# EAGLE design EMI Shielding Test (EAGLE 9.6.2)

## Sheet 1 of 2
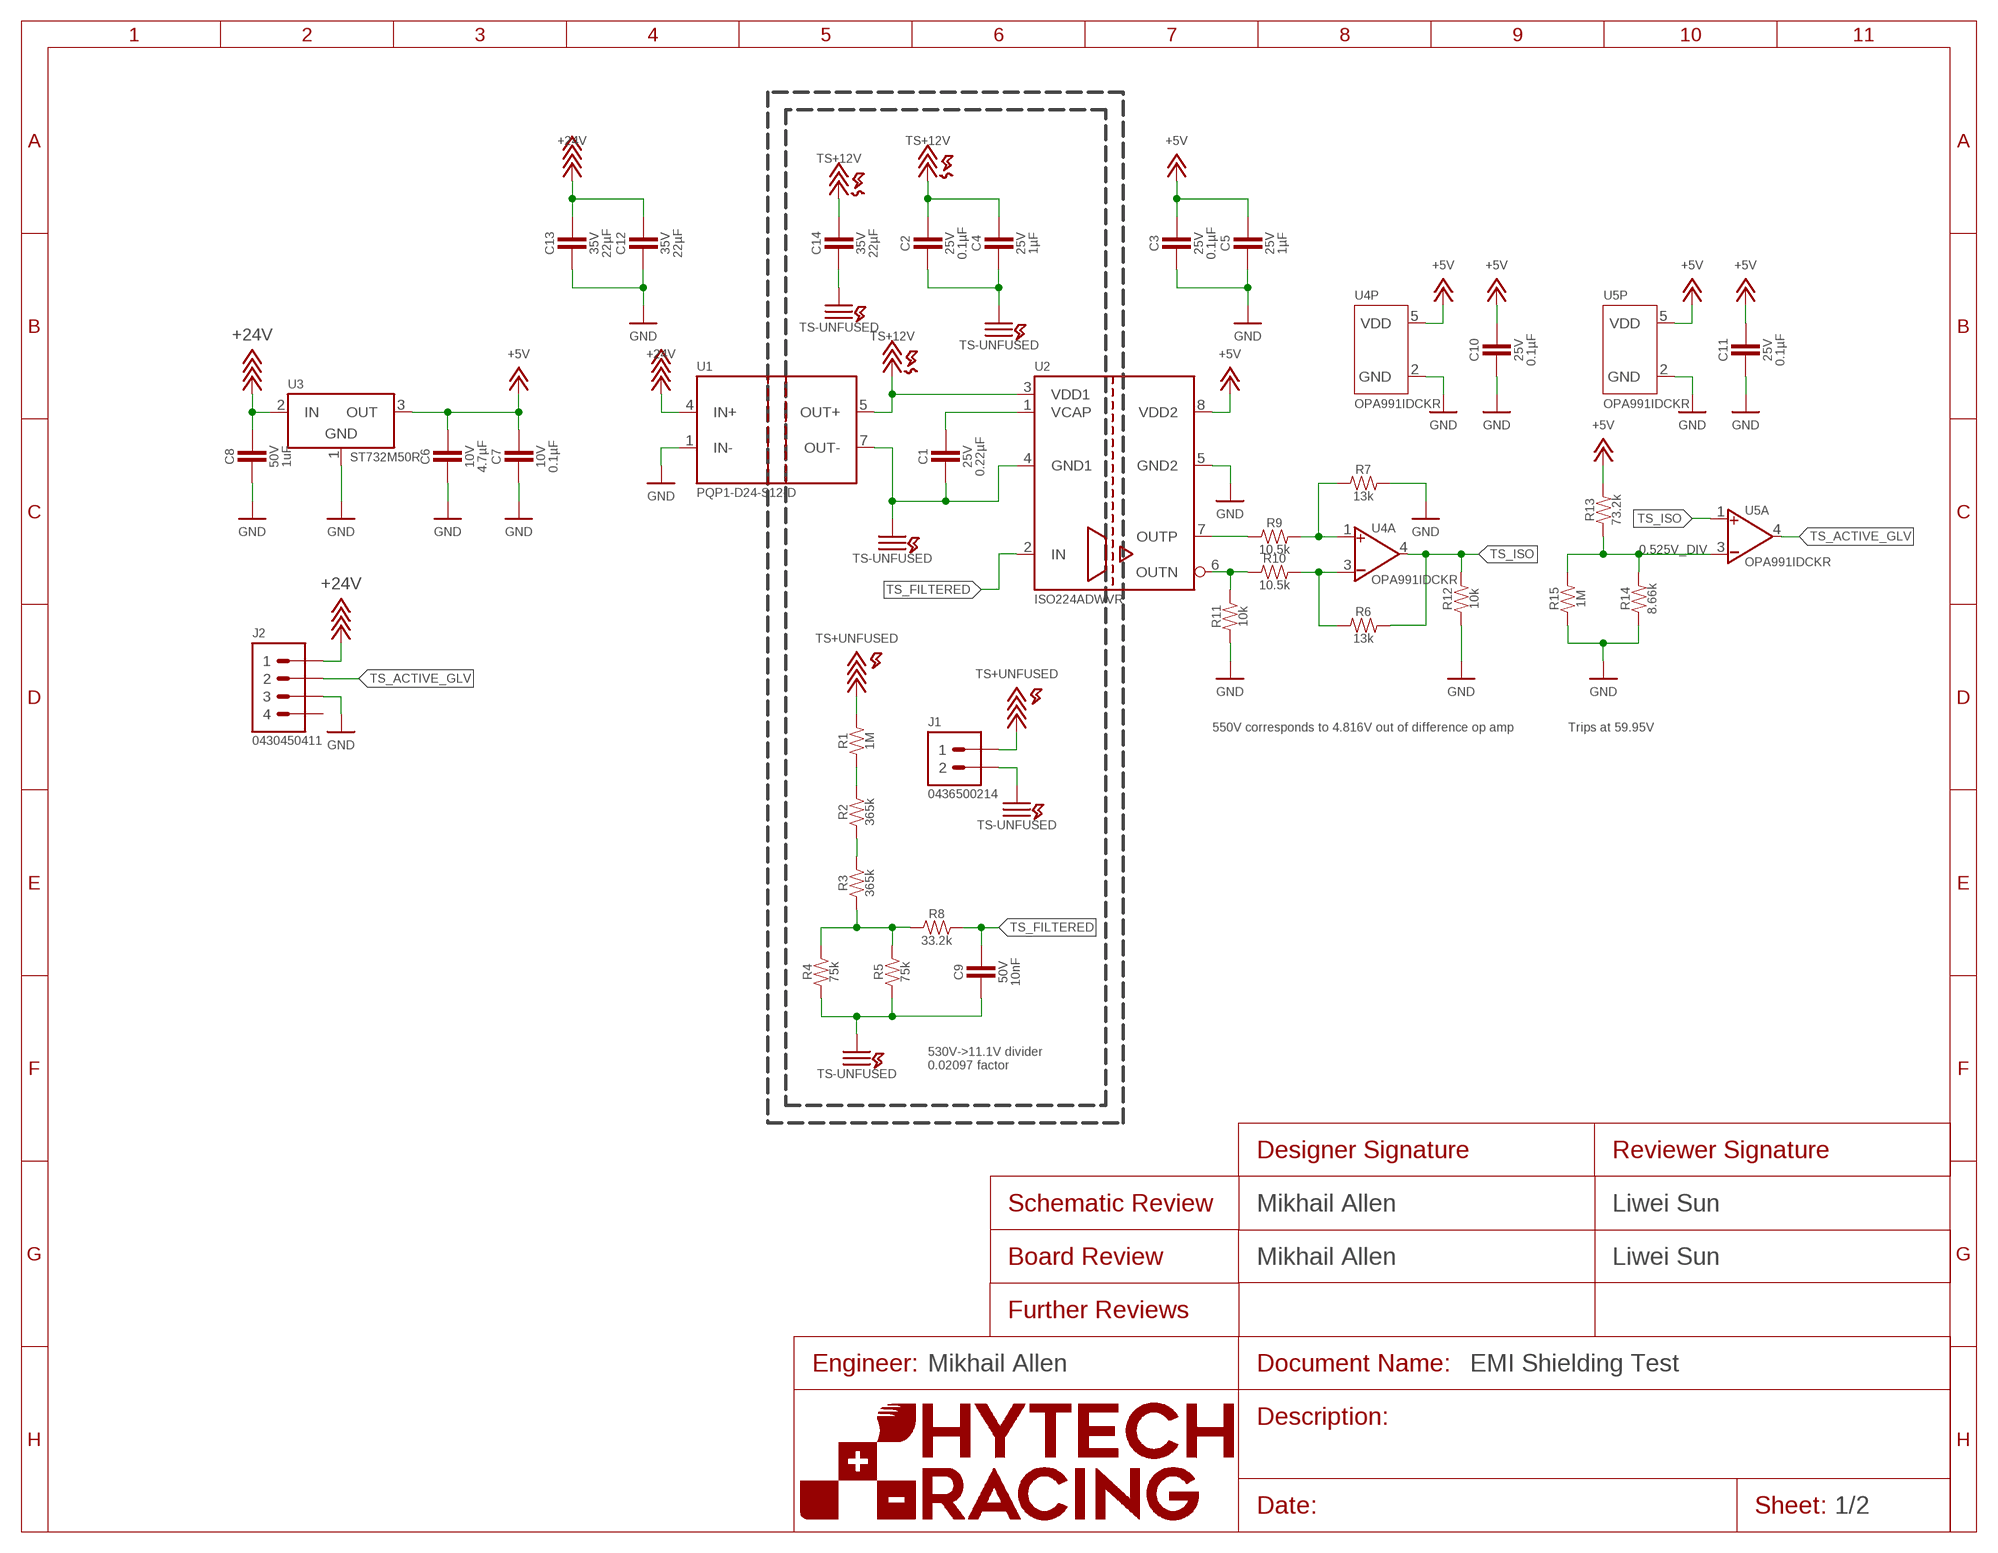
[diagram p0: schematic, sheet 1]
FRAME1 (FRAME): DESIGNER_BOARD: Mikhail Allen; DESIGNER_SCHEMATIC: Mikhail Allen; ENGINEER: Mikhail Allen; REVIEWER_BOARD: Liwei Sun; REVIEWER_SCHEMATIC: Liwei Sun

### Parts
C1  CAPACITOR_0603_25V_0.22UF  [0603-CAP]
C2  CAPACITOR_0603_25V_0.1UF  [0603-CAP]
C3  CAPACITOR_0603_25V_0.1UF  [0603-CAP]
C4  CAPACITOR_0603_25V_1UF  [0603-CAP]
C5  CAPACITOR_0603_25V_1UF  [0603-CAP]
C6  CAPACITOR_0603_10V_4.7UF  [0603-CAP]
C7  CAPACITOR_0603_10V_0.1UF  [0603-CAP]
C8  CAPACITOR_0603_50V_1UF  [0603-CAP]
C9  CAPACITOR_0603_50V_10NF  [0603-CAP]
C10  CAPACITOR_0603_25V_0.1UF  [0603-CAP]
C11  CAPACITOR_0603_25V_0.1UF  [0603-CAP]
C12  CAPACITOR_1206_35V_22UF  [1206-CAP]
C13  CAPACITOR_1206_35V_22UF  [1206-CAP]
C14  CAPACITOR_1206_35V_22UF  [1206-CAP]
J1  CONNECTOR-2_MICROFIT_SMD_RIGHTANGLE_02_SINGLE_BLACK  [MOLEX_MICROFIT_SMD_RIGHTANGLE_02_SINGLE]
J2  CONNECTOR-4_μF_S_RA_  [MOLEX_MICROFIT_SMD_RIGHTANGLE_04_DUAL]
R1  RESISTOR_0805_1M  [0805-RES]
R2  RESISTOR_0805_365K  [0805-RES]
R3  RESISTOR_0805_365K  [0805-RES]
R4  RESISTOR_0805_HV75K  [0805-RES]
R5  RESISTOR_0805_HV75K  [0805-RES]
R6  RESISTOR_0603_13K  [0603-RES]
R7  RESISTOR_0603_13K  [0603-RES]
R8  RESISTOR_0603_33.2K  [0603-RES]
R9  RESISTOR_0603_10.5K  [0603-RES]
R10  RESISTOR_0603_10.5K  [0603-RES]
R11  RESISTOR_0603_10K  [0603-RES]
R12  RESISTOR_0603_10K  [0603-RES]
R13  RESISTOR_0603_73.2K  [0603-RES]
R14  RESISTOR_0603_8.66K  [0603-RES]
R15  RESISTOR_0603_1M  [0603-RES]
U1  VOLTAGE_REGULATOR_ISO_PQP1-D_  VOLTAGE_REGULATOR_ISO_PQP1-D_D24-S12  [PQP1-D]
U2  ISO224A_AIRGAP  [SOIC-08(WIDE,0.295")-AIRGAP]
U3  VOLTAGE_REGULATOR_SOT-23-5_5V  [SOT-23-5]
U4  OPAMP_1_CHANNEL_OPA991  [SC-70-5]
U5  OPAMP_1_CHANNEL_OPA991  [SC-70-5]

### Nets
0.525V_DIV: R13.1 R14.2 R15.2 U5.3(A:VIN-)
+5V: C3.1 C5.1 C6.1 C7.1 C10.1 C11.1 R13.2 U2.8(VDD2) U3.3(OUT) U4.5(P:VDD) U5.5(P:VDD)
+24V: C8.1 C12.1 C13.1 J2.1 U1.4(IN+) U3.2(IN)
GND: C3.2 C5.2 C6.2 C7.2 C8.2 C10.2 C11.2 C12.2 C13.2 J2.3 R7.2 R11.1 R12.1 R14.1 R15.1 U1.1(IN-) U2.5(GND2) U3.1(GND) U4.2(P:GND) U5.2(P:GND)
N$1: C1.1 U2.1(VCAP)
N$2: R7.1 R9.2 U4.1(A:VIN+)
N$3: R6.1 R10.2 U4.3(A:VIN-)
N$4: R2.1 R3.2
N$5: R1.1 R2.2
N$7: R10.1 R11.2 U2.6(OUTN)
N$8: R9.1 U2.7(OUTP)
TS+12V: C2.1 C4.1 C14.1 U1.5(OUT+) U2.3(VDD1)
TS+UNFUSED: J1.1 R1.2
TS-UNFUSED: C1.2 C2.2 C4.2 C9.2 C14.2 J1.2 R4.1 R5.1 U1.7(OUT-) U2.4(GND1)
TS_ACTIVE_GLV: J2.2 U5.4(A:VOUT)
TS_DIVIDED: R3.1 R4.2 R5.2 R8.1
TS_FILTERED: C9.1 R8.2 U2.2(IN)
TS_ISO: R6.2 R12.2 U4.4(A:VOUT) U5.1(A:VIN+)
Unconnected: J2.4

### Notes on the sheet
- 550V corresponds to 4.816V out of difference op amp | Trips at 59.95V
- 530V->11.1V divider
  0.02097 factor

## Sheet 2 of 2
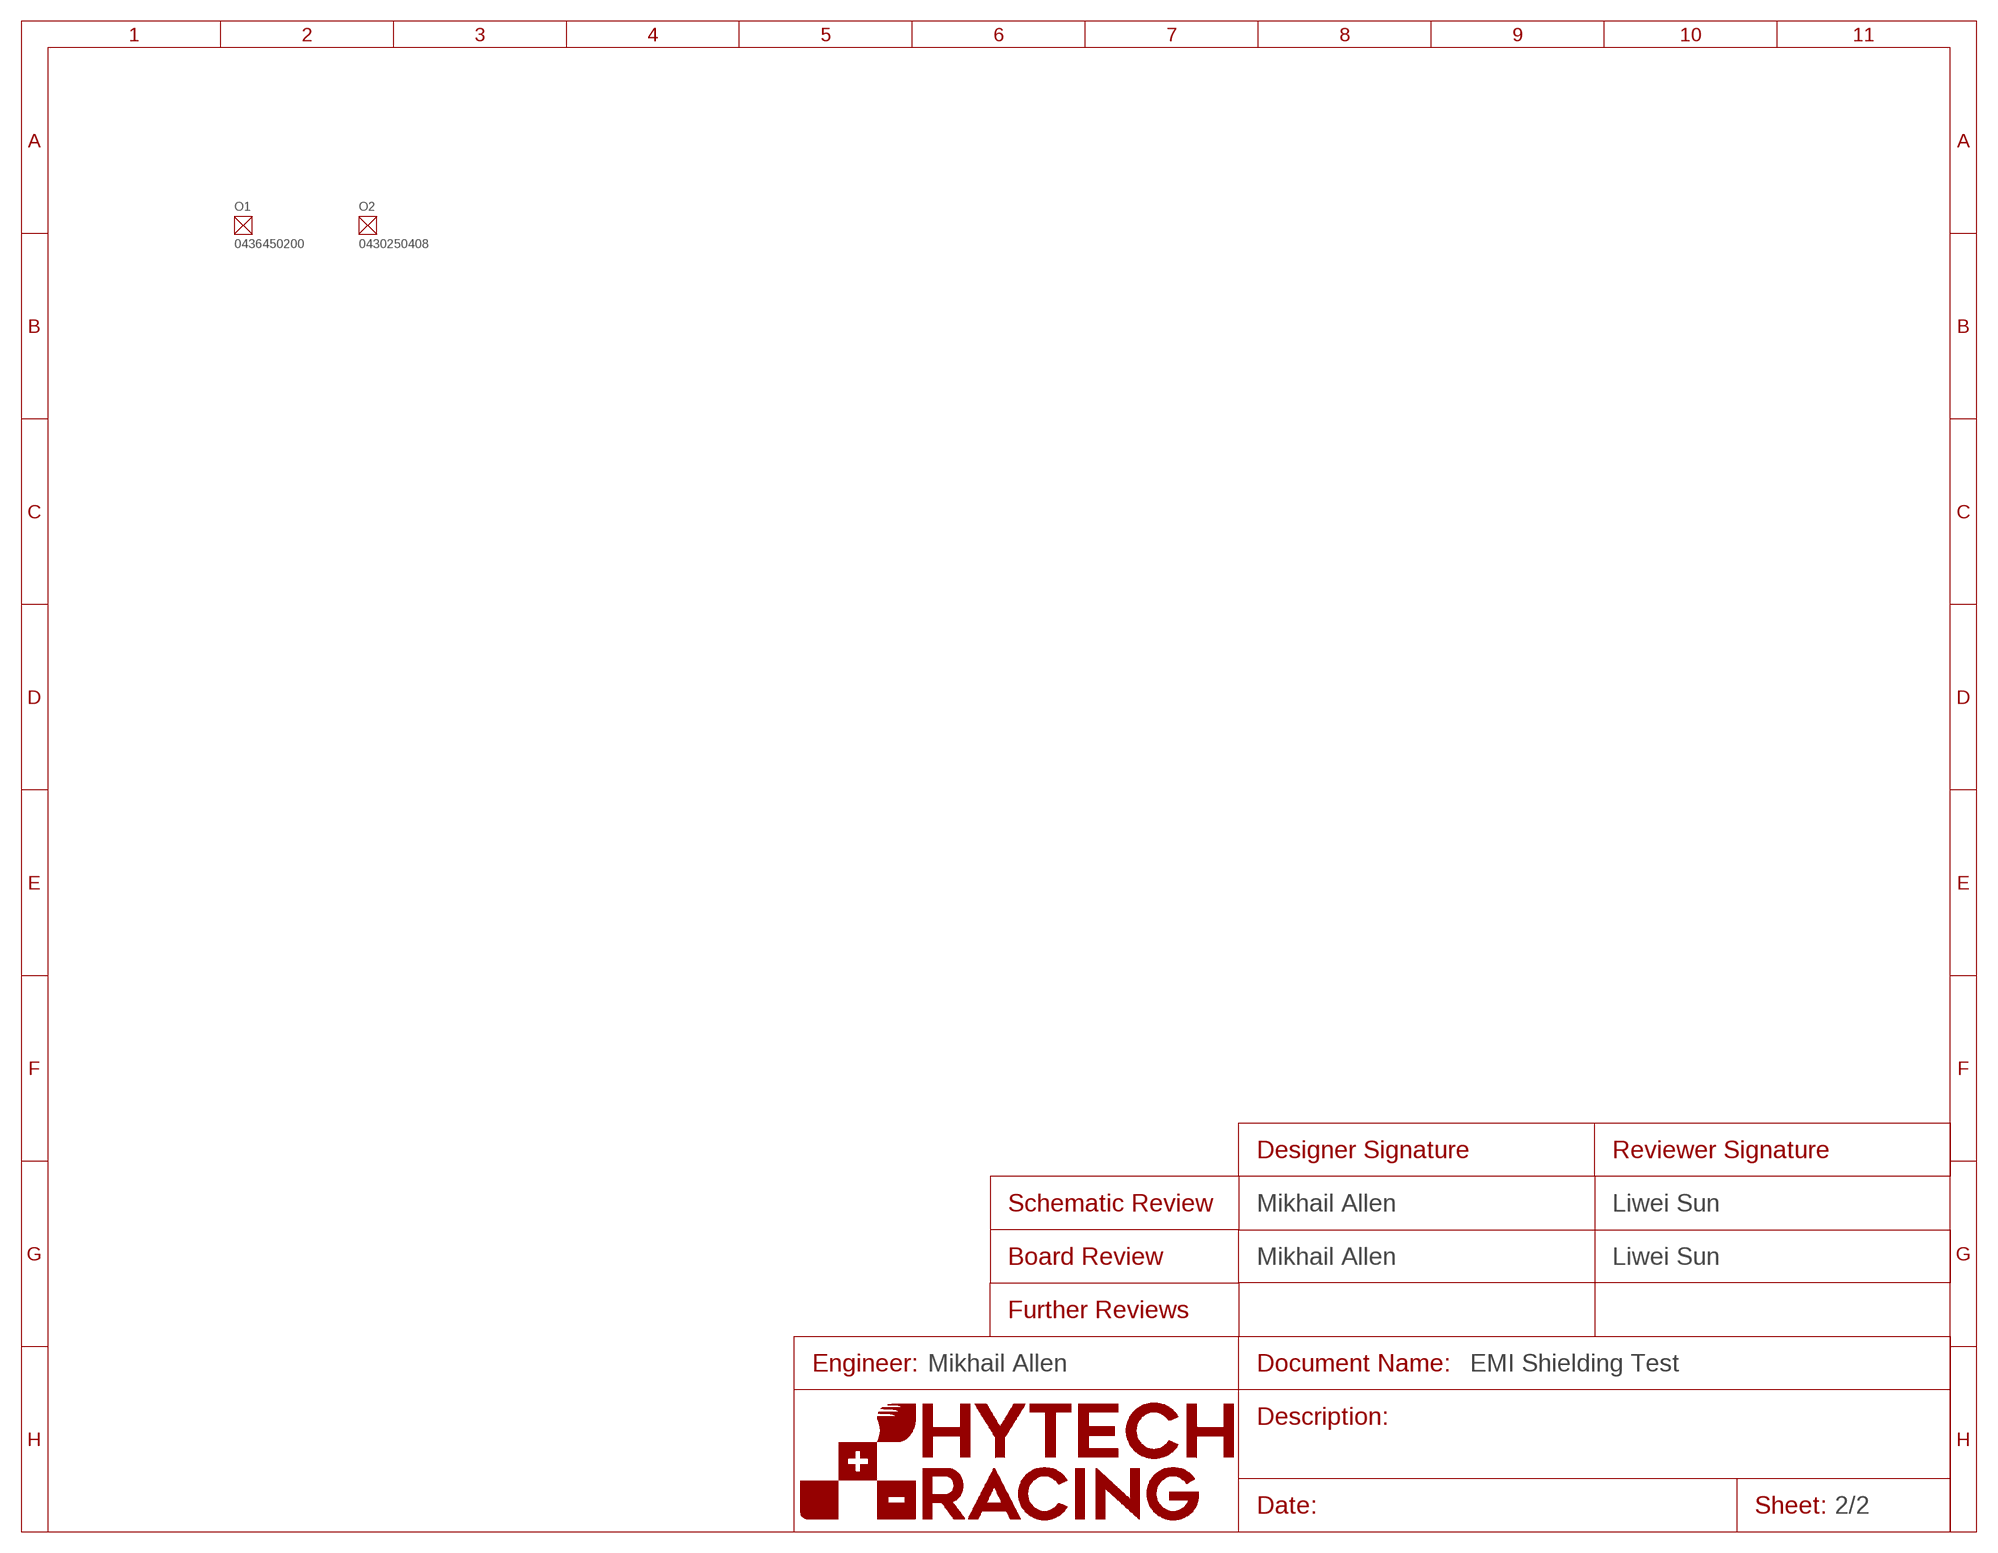
[diagram p1: schematic, sheet 2]
FRAME2 (FRAME): DESIGNER_BOARD: Mikhail Allen; DESIGNER_SCHEMATIC: Mikhail Allen; ENGINEER: Mikhail Allen; REVIEWER_BOARD: Liwei Sun; REVIEWER_SCHEMATIC: Liwei Sun
O1 (RECEPTACLE-2_MICROFIT): DKPN: WM1845-ND; MANUFACTURER: Molex; MOPN: 538-43645-0200; MPN: 0436450200
O2 (RECEPTACLE-4_MICROFIT): DKPN: WM11225-ND; MANUFACTURER: Molex; MOPN: 538-43025-0408; MPN: 0430250408

## Library data of the parts
C1 = HyTechDevices:CAPACITOR_?_*: Capacitor, Non-Polarized VJ...1BC Series Datasheet <https://www.mouser.com/datasheet/2/427/vjw1bcbascomseries-1762447.pdf> Samsung Datasheet <https://www.mouser.com/datasheet/2/585/MLCC-1837944.pdf> Walsin Datasheet <https://www.mouser.com/datasheet/2/210/WTC_MLCC_General_Purpose-1534899.pdf> GRM188R61A226ME15D <https://www.mouser.com/datasheet/2/281/1/GRM188R61A226ME15_02A-1985787.pdf> GRM188R61E106MA73D <https://www.mouser.com/datasheet/2/281/1/GRM188R61E106MA73_01A-1985806.pdf> 885012006013 <https://www.mouser.com/datasheet/2/445/885012006013-1726946.pdf> 2220Y6300105KXTWS2 <https://www.mouser.com/datasheet/2/218/SMD_High_and_Std_StackiCap_P62-1825512.pdf> Yageo Class 2, X5R <https://www.mouser.com/datasheet/2/447/UPY_GPHC_X5R_4V_to_50V_26-1827097.pdf> TDK C Series <https://www.mouser.com/ProductDetail/TDK/C3216X5R1V226M160AC?qs=%2Fha2pyFadujbcx9jh7lYl%2F4NeMoXFhdc8AqVWNq4wW6M2y7zl6GzBuhgtI0ngznN> AVX Automotive MLCC <https://www.mouser.com/datasheet/2/40/AutoMLCC-777028.pdf> KEMET X7R Series <https://www.mouser.com/datasheet/2/212/KEM_C1002_X7R_SMD-1102033.pdf> Kyocera AVX <https://www.mouser.com/datasheet/2/40/C0GNP0_Dielectric-951274.pdf> GRM21BR61H <https://www.mouser.com/datasheet/2/281/1/GRM21BR61H106KE43_01A-1986884.pdf> C1812W104KDRACTU <https://www.mouser.com/datasheet/2/212/KEM_C1034_X7R_HV_ARC_SMD-1101730.pdf>; CAPACITANCE: 0.22µF; DKPN: 1292-1420-1-ND; MANUFACTURER: Walsin Technology Corporation; MOPN: 791-0603B224K250CT; MPN: 0603B224K250CT; TOLERANCE: 10%; VOLTAGE: 25V
C2 C3 C10 C11 = HyTechDevices:CAPACITOR_?_*: Capacitor, Non-Polarized VJ...1BC Series Datasheet <https://www.mouser.com/datasheet/2/427/vjw1bcbascomseries-1762447.pdf> Samsung Datasheet <https://www.mouser.com/datasheet/2/585/MLCC-1837944.pdf> Walsin Datasheet <https://www.mouser.com/datasheet/2/210/WTC_MLCC_General_Purpose-1534899.pdf> GRM188R61A226ME15D <https://www.mouser.com/datasheet/2/281/1/GRM188R61A226ME15_02A-1985787.pdf> GRM188R61E106MA73D <https://www.mouser.com/datasheet/2/281/1/GRM188R61E106MA73_01A-1985806.pdf> 885012006013 <https://www.mouser.com/datasheet/2/445/885012006013-1726946.pdf> 2220Y6300105KXTWS2 <https://www.mouser.com/datasheet/2/218/SMD_High_and_Std_StackiCap_P62-1825512.pdf> Yageo Class 2, X5R <https://www.mouser.com/datasheet/2/447/UPY_GPHC_X5R_4V_to_50V_26-1827097.pdf> TDK C Series <https://www.mouser.com/ProductDetail/TDK/C3216X5R1V226M160AC?qs=%2Fha2pyFadujbcx9jh7lYl%2F4NeMoXFhdc8AqVWNq4wW6M2y7zl6GzBuhgtI0ngznN> AVX Automotive MLCC <https://www.mouser.com/datasheet/2/40/AutoMLCC-777028.pdf> KEMET X7R Series <https://www.mouser.com/datasheet/2/212/KEM_C1002_X7R_SMD-1102033.pdf> Kyocera AVX <https://www.mouser.com/datasheet/2/40/C0GNP0_Dielectric-951274.pdf> GRM21BR61H <https://www.mouser.com/datasheet/2/281/1/GRM21BR61H106KE43_01A-1986884.pdf> C1812W104KDRACTU <https://www.mouser.com/datasheet/2/212/KEM_C1034_X7R_HV_ARC_SMD-1101730.pdf>; CAPACITANCE: 0.1µF; DKPN: 1276-1006-1-ND; MANUFACTURER: Samsung Electro-Mechanics; MOPN: 187-CL10B104KA8NNNC; MPN: CL10B104KA8NNNC; TOLERANCE: 10%; VOLTAGE: 25V
C4 C5 = HyTechDevices:CAPACITOR_?_*: Capacitor, Non-Polarized VJ...1BC Series Datasheet <https://www.mouser.com/datasheet/2/427/vjw1bcbascomseries-1762447.pdf> Samsung Datasheet <https://www.mouser.com/datasheet/2/585/MLCC-1837944.pdf> Walsin Datasheet <https://www.mouser.com/datasheet/2/210/WTC_MLCC_General_Purpose-1534899.pdf> GRM188R61A226ME15D <https://www.mouser.com/datasheet/2/281/1/GRM188R61A226ME15_02A-1985787.pdf> GRM188R61E106MA73D <https://www.mouser.com/datasheet/2/281/1/GRM188R61E106MA73_01A-1985806.pdf> 885012006013 <https://www.mouser.com/datasheet/2/445/885012006013-1726946.pdf> 2220Y6300105KXTWS2 <https://www.mouser.com/datasheet/2/218/SMD_High_and_Std_StackiCap_P62-1825512.pdf> Yageo Class 2, X5R <https://www.mouser.com/datasheet/2/447/UPY_GPHC_X5R_4V_to_50V_26-1827097.pdf> TDK C Series <https://www.mouser.com/ProductDetail/TDK/C3216X5R1V226M160AC?qs=%2Fha2pyFadujbcx9jh7lYl%2F4NeMoXFhdc8AqVWNq4wW6M2y7zl6GzBuhgtI0ngznN> AVX Automotive MLCC <https://www.mouser.com/datasheet/2/40/AutoMLCC-777028.pdf> KEMET X7R Series <https://www.mouser.com/datasheet/2/212/KEM_C1002_X7R_SMD-1102033.pdf> Kyocera AVX <https://www.mouser.com/datasheet/2/40/C0GNP0_Dielectric-951274.pdf> GRM21BR61H <https://www.mouser.com/datasheet/2/281/1/GRM21BR61H106KE43_01A-1986884.pdf> C1812W104KDRACTU <https://www.mouser.com/datasheet/2/212/KEM_C1034_X7R_HV_ARC_SMD-1101730.pdf>; CAPACITANCE: 1µF; DKPN: 1276-1184-1-ND; MANUFACTURER: Samsung Electro-Mechanics; MOPN: 187-CL10B105KA8NNNC; MPN: CL10B105KA8NNNC; TOLERANCE: 10%; VOLTAGE: 25V
C6 = HyTechDevices:CAPACITOR_?_*: Capacitor, Non-Polarized VJ...1BC Series Datasheet <https://www.mouser.com/datasheet/2/427/vjw1bcbascomseries-1762447.pdf> Samsung Datasheet <https://www.mouser.com/datasheet/2/585/MLCC-1837944.pdf> Walsin Datasheet <https://www.mouser.com/datasheet/2/210/WTC_MLCC_General_Purpose-1534899.pdf> GRM188R61A226ME15D <https://www.mouser.com/datasheet/2/281/1/GRM188R61A226ME15_02A-1985787.pdf> GRM188R61E106MA73D <https://www.mouser.com/datasheet/2/281/1/GRM188R61E106MA73_01A-1985806.pdf> 885012006013 <https://www.mouser.com/datasheet/2/445/885012006013-1726946.pdf> 2220Y6300105KXTWS2 <https://www.mouser.com/datasheet/2/218/SMD_High_and_Std_StackiCap_P62-1825512.pdf> Yageo Class 2, X5R <https://www.mouser.com/datasheet/2/447/UPY_GPHC_X5R_4V_to_50V_26-1827097.pdf> TDK C Series <https://www.mouser.com/ProductDetail/TDK/C3216X5R1V226M160AC?qs=%2Fha2pyFadujbcx9jh7lYl%2F4NeMoXFhdc8AqVWNq4wW6M2y7zl6GzBuhgtI0ngznN> AVX Automotive MLCC <https://www.mouser.com/datasheet/2/40/AutoMLCC-777028.pdf> KEMET X7R Series <https://www.mouser.com/datasheet/2/212/KEM_C1002_X7R_SMD-1102033.pdf> Kyocera AVX <https://www.mouser.com/datasheet/2/40/C0GNP0_Dielectric-951274.pdf> GRM21BR61H <https://www.mouser.com/datasheet/2/281/1/GRM21BR61H106KE43_01A-1986884.pdf> C1812W104KDRACTU <https://www.mouser.com/datasheet/2/212/KEM_C1034_X7R_HV_ARC_SMD-1101730.pdf>; CAPACITANCE: 4.7µF; DKPN: 1276-1044-1-ND; MANUFACTURER: Samsung Electro-Mechanics; MOPN: 187-CL10A475KP8NNNC; MPN: CL10A475KP8NNNC; TOLERANCE: 10%; VOLTAGE: 10V
C7 = HyTechDevices:CAPACITOR_?_*: Capacitor, Non-Polarized VJ...1BC Series Datasheet <https://www.mouser.com/datasheet/2/427/vjw1bcbascomseries-1762447.pdf> Samsung Datasheet <https://www.mouser.com/datasheet/2/585/MLCC-1837944.pdf> Walsin Datasheet <https://www.mouser.com/datasheet/2/210/WTC_MLCC_General_Purpose-1534899.pdf> GRM188R61A226ME15D <https://www.mouser.com/datasheet/2/281/1/GRM188R61A226ME15_02A-1985787.pdf> GRM188R61E106MA73D <https://www.mouser.com/datasheet/2/281/1/GRM188R61E106MA73_01A-1985806.pdf> 885012006013 <https://www.mouser.com/datasheet/2/445/885012006013-1726946.pdf> 2220Y6300105KXTWS2 <https://www.mouser.com/datasheet/2/218/SMD_High_and_Std_StackiCap_P62-1825512.pdf> Yageo Class 2, X5R <https://www.mouser.com/datasheet/2/447/UPY_GPHC_X5R_4V_to_50V_26-1827097.pdf> TDK C Series <https://www.mouser.com/ProductDetail/TDK/C3216X5R1V226M160AC?qs=%2Fha2pyFadujbcx9jh7lYl%2F4NeMoXFhdc8AqVWNq4wW6M2y7zl6GzBuhgtI0ngznN> AVX Automotive MLCC <https://www.mouser.com/datasheet/2/40/AutoMLCC-777028.pdf> KEMET X7R Series <https://www.mouser.com/datasheet/2/212/KEM_C1002_X7R_SMD-1102033.pdf> Kyocera AVX <https://www.mouser.com/datasheet/2/40/C0GNP0_Dielectric-951274.pdf> GRM21BR61H <https://www.mouser.com/datasheet/2/281/1/GRM21BR61H106KE43_01A-1986884.pdf> C1812W104KDRACTU <https://www.mouser.com/datasheet/2/212/KEM_C1034_X7R_HV_ARC_SMD-1101730.pdf>; CAPACITANCE: 0.1µF; DKPN: 720-1688-1-ND; MANUFACTURER: Vishay Vitramon; MOPN: 77-VJ0603Y104JXQPBC; MPN: VJ0603Y104JXQPW1BC; TOLERANCE: 5%; VOLTAGE: 10V
C8 = HyTechDevices:CAPACITOR_?_*: Capacitor, Non-Polarized VJ...1BC Series Datasheet <https://www.mouser.com/datasheet/2/427/vjw1bcbascomseries-1762447.pdf> Samsung Datasheet <https://www.mouser.com/datasheet/2/585/MLCC-1837944.pdf> Walsin Datasheet <https://www.mouser.com/datasheet/2/210/WTC_MLCC_General_Purpose-1534899.pdf> GRM188R61A226ME15D <https://www.mouser.com/datasheet/2/281/1/GRM188R61A226ME15_02A-1985787.pdf> GRM188R61E106MA73D <https://www.mouser.com/datasheet/2/281/1/GRM188R61E106MA73_01A-1985806.pdf> 885012006013 <https://www.mouser.com/datasheet/2/445/885012006013-1726946.pdf> 2220Y6300105KXTWS2 <https://www.mouser.com/datasheet/2/218/SMD_High_and_Std_StackiCap_P62-1825512.pdf> Yageo Class 2, X5R <https://www.mouser.com/datasheet/2/447/UPY_GPHC_X5R_4V_to_50V_26-1827097.pdf> TDK C Series <https://www.mouser.com/ProductDetail/TDK/C3216X5R1V226M160AC?qs=%2Fha2pyFadujbcx9jh7lYl%2F4NeMoXFhdc8AqVWNq4wW6M2y7zl6GzBuhgtI0ngznN> AVX Automotive MLCC <https://www.mouser.com/datasheet/2/40/AutoMLCC-777028.pdf> KEMET X7R Series <https://www.mouser.com/datasheet/2/212/KEM_C1002_X7R_SMD-1102033.pdf> Kyocera AVX <https://www.mouser.com/datasheet/2/40/C0GNP0_Dielectric-951274.pdf> GRM21BR61H <https://www.mouser.com/datasheet/2/281/1/GRM21BR61H106KE43_01A-1986884.pdf> C1812W104KDRACTU <https://www.mouser.com/datasheet/2/212/KEM_C1034_X7R_HV_ARC_SMD-1101730.pdf>; CAPACITANCE: 1uF; DKPN: 587-2400-2-ND; MANUFACTURER: Taiyo Yuden; MOPN: 963-UMK107BJ105KA-T; MPN: UMK107BJ105KA-T; TOLERANCE: 10%; VOLTAGE: 50V
C9 = HyTechDevices:CAPACITOR_?_*: Capacitor, Non-Polarized VJ...1BC Series Datasheet <https://www.mouser.com/datasheet/2/427/vjw1bcbascomseries-1762447.pdf> Samsung Datasheet <https://www.mouser.com/datasheet/2/585/MLCC-1837944.pdf> Walsin Datasheet <https://www.mouser.com/datasheet/2/210/WTC_MLCC_General_Purpose-1534899.pdf> GRM188R61A226ME15D <https://www.mouser.com/datasheet/2/281/1/GRM188R61A226ME15_02A-1985787.pdf> GRM188R61E106MA73D <https://www.mouser.com/datasheet/2/281/1/GRM188R61E106MA73_01A-1985806.pdf> 885012006013 <https://www.mouser.com/datasheet/2/445/885012006013-1726946.pdf> 2220Y6300105KXTWS2 <https://www.mouser.com/datasheet/2/218/SMD_High_and_Std_StackiCap_P62-1825512.pdf> Yageo Class 2, X5R <https://www.mouser.com/datasheet/2/447/UPY_GPHC_X5R_4V_to_50V_26-1827097.pdf> TDK C Series <https://www.mouser.com/ProductDetail/TDK/C3216X5R1V226M160AC?qs=%2Fha2pyFadujbcx9jh7lYl%2F4NeMoXFhdc8AqVWNq4wW6M2y7zl6GzBuhgtI0ngznN> AVX Automotive MLCC <https://www.mouser.com/datasheet/2/40/AutoMLCC-777028.pdf> KEMET X7R Series <https://www.mouser.com/datasheet/2/212/KEM_C1002_X7R_SMD-1102033.pdf> Kyocera AVX <https://www.mouser.com/datasheet/2/40/C0GNP0_Dielectric-951274.pdf> GRM21BR61H <https://www.mouser.com/datasheet/2/281/1/GRM21BR61H106KE43_01A-1986884.pdf> C1812W104KDRACTU <https://www.mouser.com/datasheet/2/212/KEM_C1034_X7R_HV_ARC_SMD-1101730.pdf>; CAPACITANCE: 10nF; DKPN: 445-7404-1-ND; MANUFACTURER: TDK Corporation; MOPN: 810-C1608C0G1H103J; MPN: C1608C0G1H103J080AA; TOLERANCE: 5%; VOLTAGE: 50V
C12-C14 = HyTechDevices:CAPACITOR_?_*: Capacitor, Non-Polarized VJ...1BC Series Datasheet <https://www.mouser.com/datasheet/2/427/vjw1bcbascomseries-1762447.pdf> Samsung Datasheet <https://www.mouser.com/datasheet/2/585/MLCC-1837944.pdf> Walsin Datasheet <https://www.mouser.com/datasheet/2/210/WTC_MLCC_General_Purpose-1534899.pdf> GRM188R61A226ME15D <https://www.mouser.com/datasheet/2/281/1/GRM188R61A226ME15_02A-1985787.pdf> GRM188R61E106MA73D <https://www.mouser.com/datasheet/2/281/1/GRM188R61E106MA73_01A-1985806.pdf> 885012006013 <https://www.mouser.com/datasheet/2/445/885012006013-1726946.pdf> 2220Y6300105KXTWS2 <https://www.mouser.com/datasheet/2/218/SMD_High_and_Std_StackiCap_P62-1825512.pdf> Yageo Class 2, X5R <https://www.mouser.com/datasheet/2/447/UPY_GPHC_X5R_4V_to_50V_26-1827097.pdf> TDK C Series <https://www.mouser.com/ProductDetail/TDK/C3216X5R1V226M160AC?qs=%2Fha2pyFadujbcx9jh7lYl%2F4NeMoXFhdc8AqVWNq4wW6M2y7zl6GzBuhgtI0ngznN> AVX Automotive MLCC <https://www.mouser.com/datasheet/2/40/AutoMLCC-777028.pdf> KEMET X7R Series <https://www.mouser.com/datasheet/2/212/KEM_C1002_X7R_SMD-1102033.pdf> Kyocera AVX <https://www.mouser.com/datasheet/2/40/C0GNP0_Dielectric-951274.pdf> GRM21BR61H <https://www.mouser.com/datasheet/2/281/1/GRM21BR61H106KE43_01A-1986884.pdf> C1812W104KDRACTU <https://www.mouser.com/datasheet/2/212/KEM_C1034_X7R_HV_ARC_SMD-1101730.pdf>; CAPACITANCE: 22µF; DKPN: 445-8045-1-ND; MANUFACTURER: TDK Corporation; MOPN: 810-C3216X5R1V226M; MPN: C3216X5R1V226M160AC; TOLERANCE: 20%; VOLTAGE: 35V
J1 = HyTechDevices:CONNECTOR-2_?_*: 2 Pin Connector; DKPN: WM14310CT-ND; MANUFACTURER: Molex; MOPN: 538-43650-0214; MPN: 0436500214
J2 = HyTechDevices:CONNECTOR-4_?_*: 4 Pin Connector; DKPN: WM1832CT-ND; MANUFACTURER: Molex; MOPN: 538-0430450411; MPN: 0430450411
R1 = HyTechDevices:RESISTOR_?_*: Resistor PWR163 Series <https://www.mouser.com/datasheet/2/54/pwr163-777985.pdf> AC Series <https://www.mouser.com/datasheet/2/447/Yageo_PYu_AC_51_RoHS_L_7_1714230-1874691.pdf> PU Series <https://www.mouser.com/datasheet/2/447/PYu-PU_51_RoHS_L_6-1504619.pdf> ERA Series <https://www.mouser.com/datasheet/2/315/AOA0000C307-1149632.pdf> PWR263 Series <https://www.mouser.com/datasheet/2/54/pwr263s_35-778069.pdf> KTR Series <https://www.mouser.com/datasheet/2/348/ROHM_S_A0011075115_1-2563276.pdf> RC Series <https://www.mouser.com/datasheet/2/447/Yageo_03_18_2021_PYu_RC_Group_51_RoHS_L_11-2199992.pdf> ERJ PB3, PB6 Series <https://www.mouser.com/datasheet/2/315/AOA0000C328-1530132.pdf> ERJ PA2, P03, PA3, P06, P08, P14 Series <https://www.mouser.com/datasheet/2/315/AOA0000C331-1141874.pdf> B20 Series <https://www.ohmite.com/assets/docs/res_200.pdf?r=false> TE Connectivity/Holsworthy RN73 Series <https://www.mouser.com/datasheet/2/418/4/NG_DS_1773270_M-604713.pdf> Vishay Dale D/CRCW e3 <https://www.mouser.com/datasheet/2/427/dcrcwe3-1762152.pdf> Ohmite B20 <https://www.ohmite.com/assets/docs/res_200.pdf?r=false>; DKPN: P20936TR-ND; MANUFACTURER: Panasonic Electronic Components; MOPN: 667-ERJ-PB6B1004V; MPN: ERJ-PB6B1004V; POWER: 0.25W; RESISTANCE: 1M; TOLERANCE: 0.1%; VOLTAGE_CONTINUOUS: 150V; VOLTAGE_MAX: 150V
R2 R3 = HyTechDevices:RESISTOR_?_*: Resistor PWR163 Series <https://www.mouser.com/datasheet/2/54/pwr163-777985.pdf> AC Series <https://www.mouser.com/datasheet/2/447/Yageo_PYu_AC_51_RoHS_L_7_1714230-1874691.pdf> PU Series <https://www.mouser.com/datasheet/2/447/PYu-PU_51_RoHS_L_6-1504619.pdf> ERA Series <https://www.mouser.com/datasheet/2/315/AOA0000C307-1149632.pdf> PWR263 Series <https://www.mouser.com/datasheet/2/54/pwr263s_35-778069.pdf> KTR Series <https://www.mouser.com/datasheet/2/348/ROHM_S_A0011075115_1-2563276.pdf> RC Series <https://www.mouser.com/datasheet/2/447/Yageo_03_18_2021_PYu_RC_Group_51_RoHS_L_11-2199992.pdf> ERJ PB3, PB6 Series <https://www.mouser.com/datasheet/2/315/AOA0000C328-1530132.pdf> ERJ PA2, P03, PA3, P06, P08, P14 Series <https://www.mouser.com/datasheet/2/315/AOA0000C331-1141874.pdf> B20 Series <https://www.ohmite.com/assets/docs/res_200.pdf?r=false> TE Connectivity/Holsworthy RN73 Series <https://www.mouser.com/datasheet/2/418/4/NG_DS_1773270_M-604713.pdf> Vishay Dale D/CRCW e3 <https://www.mouser.com/datasheet/2/427/dcrcwe3-1762152.pdf> Ohmite B20 <https://www.ohmite.com/assets/docs/res_200.pdf?r=false>; DKPN: P20885CT-ND; MANUFACTURER: Panasonic Electronic Components; MOPN: 667-ERJ-PB6B3653V; MPN: ERJ-PB6B3653V; POWER: 0.25W; RESISTANCE: 365k; TOLERANCE: 0.1%; VOLTAGE_CONTINUOUS: 150V; VOLTAGE_MAX: 150V
R4 R5 = HyTechDevices:RESISTOR_?_*: Resistor PWR163 Series <https://www.mouser.com/datasheet/2/54/pwr163-777985.pdf> AC Series <https://www.mouser.com/datasheet/2/447/Yageo_PYu_AC_51_RoHS_L_7_1714230-1874691.pdf> PU Series <https://www.mouser.com/datasheet/2/447/PYu-PU_51_RoHS_L_6-1504619.pdf> ERA Series <https://www.mouser.com/datasheet/2/315/AOA0000C307-1149632.pdf> PWR263 Series <https://www.mouser.com/datasheet/2/54/pwr263s_35-778069.pdf> KTR Series <https://www.mouser.com/datasheet/2/348/ROHM_S_A0011075115_1-2563276.pdf> RC Series <https://www.mouser.com/datasheet/2/447/Yageo_03_18_2021_PYu_RC_Group_51_RoHS_L_11-2199992.pdf> ERJ PB3, PB6 Series <https://www.mouser.com/datasheet/2/315/AOA0000C328-1530132.pdf> ERJ PA2, P03, PA3, P06, P08, P14 Series <https://www.mouser.com/datasheet/2/315/AOA0000C331-1141874.pdf> B20 Series <https://www.ohmite.com/assets/docs/res_200.pdf?r=false> TE Connectivity/Holsworthy RN73 Series <https://www.mouser.com/datasheet/2/418/4/NG_DS_1773270_M-604713.pdf> Vishay Dale D/CRCW e3 <https://www.mouser.com/datasheet/2/427/dcrcwe3-1762152.pdf> Ohmite B20 <https://www.ohmite.com/assets/docs/res_200.pdf?r=false>; DKPN: RHM75KAHTR-ND; MANUFACTURER: Rohm Semiconductor; MOPN: 755-KTR10EZPF7502; MPN: KTR10EZPF7502; POWER: 0.125W; RESISTANCE: 75k; TOLERANCE: 1%; VOLTAGE_CONTINUOUS: 96.8V; VOLTAGE_MAX: 400V
R6 R7 = HyTechDevices:RESISTOR_?_*: Resistor PWR163 Series <https://www.mouser.com/datasheet/2/54/pwr163-777985.pdf> AC Series <https://www.mouser.com/datasheet/2/447/Yageo_PYu_AC_51_RoHS_L_7_1714230-1874691.pdf> PU Series <https://www.mouser.com/datasheet/2/447/PYu-PU_51_RoHS_L_6-1504619.pdf> ERA Series <https://www.mouser.com/datasheet/2/315/AOA0000C307-1149632.pdf> PWR263 Series <https://www.mouser.com/datasheet/2/54/pwr263s_35-778069.pdf> KTR Series <https://www.mouser.com/datasheet/2/348/ROHM_S_A0011075115_1-2563276.pdf> RC Series <https://www.mouser.com/datasheet/2/447/Yageo_03_18_2021_PYu_RC_Group_51_RoHS_L_11-2199992.pdf> ERJ PB3, PB6 Series <https://www.mouser.com/datasheet/2/315/AOA0000C328-1530132.pdf> ERJ PA2, P03, PA3, P06, P08, P14 Series <https://www.mouser.com/datasheet/2/315/AOA0000C331-1141874.pdf> B20 Series <https://www.ohmite.com/assets/docs/res_200.pdf?r=false> TE Connectivity/Holsworthy RN73 Series <https://www.mouser.com/datasheet/2/418/4/NG_DS_1773270_M-604713.pdf> Vishay Dale D/CRCW e3 <https://www.mouser.com/datasheet/2/427/dcrcwe3-1762152.pdf> Ohmite B20 <https://www.ohmite.com/assets/docs/res_200.pdf?r=false>; DKPN: P13KBECT-ND; MANUFACTURER: Panasonic Electronic Components; MOPN: 667-ERA-3ARW133V; MPN: ERA-3ARW133V; POWER: 0.1W; RESISTANCE: 13k; TOLERANCE: 0.05%; VOLTAGE_CONTINUOUS: 75V; VOLTAGE_MAX: 150V
R8 = HyTechDevices:RESISTOR_?_*: Resistor PWR163 Series <https://www.mouser.com/datasheet/2/54/pwr163-777985.pdf> AC Series <https://www.mouser.com/datasheet/2/447/Yageo_PYu_AC_51_RoHS_L_7_1714230-1874691.pdf> PU Series <https://www.mouser.com/datasheet/2/447/PYu-PU_51_RoHS_L_6-1504619.pdf> ERA Series <https://www.mouser.com/datasheet/2/315/AOA0000C307-1149632.pdf> PWR263 Series <https://www.mouser.com/datasheet/2/54/pwr263s_35-778069.pdf> KTR Series <https://www.mouser.com/datasheet/2/348/ROHM_S_A0011075115_1-2563276.pdf> RC Series <https://www.mouser.com/datasheet/2/447/Yageo_03_18_2021_PYu_RC_Group_51_RoHS_L_11-2199992.pdf> ERJ PB3, PB6 Series <https://www.mouser.com/datasheet/2/315/AOA0000C328-1530132.pdf> ERJ PA2, P03, PA3, P06, P08, P14 Series <https://www.mouser.com/datasheet/2/315/AOA0000C331-1141874.pdf> B20 Series <https://www.ohmite.com/assets/docs/res_200.pdf?r=false> TE Connectivity/Holsworthy RN73 Series <https://www.mouser.com/datasheet/2/418/4/NG_DS_1773270_M-604713.pdf> Vishay Dale D/CRCW e3 <https://www.mouser.com/datasheet/2/427/dcrcwe3-1762152.pdf> Ohmite B20 <https://www.ohmite.com/assets/docs/res_200.pdf?r=false>; DKPN: P20144TR-ND; MANUFACTURER: Panasonic Electronic Components; MOPN: 667-ERJ-PB3B3322V; MPN: ERJ-PB3B3322V; POWER: 0.1W; RESISTANCE: 33.2k; TOLERANCE: 0.1%; VOLTAGE_CONTINUOUS: 57.61V; VOLTAGE_MAX: 75V
R9 R10 = HyTechDevices:RESISTOR_?_*: Resistor PWR163 Series <https://www.mouser.com/datasheet/2/54/pwr163-777985.pdf> AC Series <https://www.mouser.com/datasheet/2/447/Yageo_PYu_AC_51_RoHS_L_7_1714230-1874691.pdf> PU Series <https://www.mouser.com/datasheet/2/447/PYu-PU_51_RoHS_L_6-1504619.pdf> ERA Series <https://www.mouser.com/datasheet/2/315/AOA0000C307-1149632.pdf> PWR263 Series <https://www.mouser.com/datasheet/2/54/pwr263s_35-778069.pdf> KTR Series <https://www.mouser.com/datasheet/2/348/ROHM_S_A0011075115_1-2563276.pdf> RC Series <https://www.mouser.com/datasheet/2/447/Yageo_03_18_2021_PYu_RC_Group_51_RoHS_L_11-2199992.pdf> ERJ PB3, PB6 Series <https://www.mouser.com/datasheet/2/315/AOA0000C328-1530132.pdf> ERJ PA2, P03, PA3, P06, P08, P14 Series <https://www.mouser.com/datasheet/2/315/AOA0000C331-1141874.pdf> B20 Series <https://www.ohmite.com/assets/docs/res_200.pdf?r=false> TE Connectivity/Holsworthy RN73 Series <https://www.mouser.com/datasheet/2/418/4/NG_DS_1773270_M-604713.pdf> Vishay Dale D/CRCW e3 <https://www.mouser.com/datasheet/2/427/dcrcwe3-1762152.pdf> Ohmite B20 <https://www.ohmite.com/assets/docs/res_200.pdf?r=false>; DKPN: P10.5KDBCT-ND; MANUFACTURER: Panasonic Electronic Components; MOPN: 677-ERA-3AEB1052V; MPN: ERA-3AEB1052V; POWER: 0.1W; RESISTANCE: 10.5k; TOLERANCE: 0.1%; VOLTAGE_CONTINUOUS: 32.40V; VOLTAGE_MAX: 75V
R11 R12 = HyTechDevices:RESISTOR_?_*: Resistor PWR163 Series <https://www.mouser.com/datasheet/2/54/pwr163-777985.pdf> AC Series <https://www.mouser.com/datasheet/2/447/Yageo_PYu_AC_51_RoHS_L_7_1714230-1874691.pdf> PU Series <https://www.mouser.com/datasheet/2/447/PYu-PU_51_RoHS_L_6-1504619.pdf> ERA Series <https://www.mouser.com/datasheet/2/315/AOA0000C307-1149632.pdf> PWR263 Series <https://www.mouser.com/datasheet/2/54/pwr263s_35-778069.pdf> KTR Series <https://www.mouser.com/datasheet/2/348/ROHM_S_A0011075115_1-2563276.pdf> RC Series <https://www.mouser.com/datasheet/2/447/Yageo_03_18_2021_PYu_RC_Group_51_RoHS_L_11-2199992.pdf> ERJ PB3, PB6 Series <https://www.mouser.com/datasheet/2/315/AOA0000C328-1530132.pdf> ERJ PA2, P03, PA3, P06, P08, P14 Series <https://www.mouser.com/datasheet/2/315/AOA0000C331-1141874.pdf> B20 Series <https://www.ohmite.com/assets/docs/res_200.pdf?r=false> TE Connectivity/Holsworthy RN73 Series <https://www.mouser.com/datasheet/2/418/4/NG_DS_1773270_M-604713.pdf> Vishay Dale D/CRCW e3 <https://www.mouser.com/datasheet/2/427/dcrcwe3-1762152.pdf> Ohmite B20 <https://www.ohmite.com/assets/docs/res_200.pdf?r=false>; DKPN: P10KBDCT-ND; MANUFACTURER: Panasonic Electronic Components; MOPN: 667-ERA-3ARB103V; MPN: ERA-3ARB103V; POWER: 0.1W; RESISTANCE: 10k; TOLERANCE: 0.1%; VOLTAGE_CONTINUOUS: 31.62V; VOLTAGE_MAX: 75V
R13 = HyTechDevices:RESISTOR_?_*: Resistor PWR163 Series <https://www.mouser.com/datasheet/2/54/pwr163-777985.pdf> AC Series <https://www.mouser.com/datasheet/2/447/Yageo_PYu_AC_51_RoHS_L_7_1714230-1874691.pdf> PU Series <https://www.mouser.com/datasheet/2/447/PYu-PU_51_RoHS_L_6-1504619.pdf> ERA Series <https://www.mouser.com/datasheet/2/315/AOA0000C307-1149632.pdf> PWR263 Series <https://www.mouser.com/datasheet/2/54/pwr263s_35-778069.pdf> KTR Series <https://www.mouser.com/datasheet/2/348/ROHM_S_A0011075115_1-2563276.pdf> RC Series <https://www.mouser.com/datasheet/2/447/Yageo_03_18_2021_PYu_RC_Group_51_RoHS_L_11-2199992.pdf> ERJ PB3, PB6 Series <https://www.mouser.com/datasheet/2/315/AOA0000C328-1530132.pdf> ERJ PA2, P03, PA3, P06, P08, P14 Series <https://www.mouser.com/datasheet/2/315/AOA0000C331-1141874.pdf> B20 Series <https://www.ohmite.com/assets/docs/res_200.pdf?r=false> TE Connectivity/Holsworthy RN73 Series <https://www.mouser.com/datasheet/2/418/4/NG_DS_1773270_M-604713.pdf> Vishay Dale D/CRCW e3 <https://www.mouser.com/datasheet/2/427/dcrcwe3-1762152.pdf> Ohmite B20 <https://www.ohmite.com/assets/docs/res_200.pdf?r=false>; DKPN: P73.2KDBCT-ND; MANUFACTURER: Panasonic Electronic Components; MOPN: 667-ERA-3AEB7322V; MPN: ERA-3AEB7322V; POWER: 0.1W; RESISTANCE: 73.2k; TOLERANCE: 0.1%; VOLTAGE_CONTINUOUS: 75V; VOLTAGE_MAX: 75V
R14 = HyTechDevices:RESISTOR_?_*: Resistor PWR163 Series <https://www.mouser.com/datasheet/2/54/pwr163-777985.pdf> AC Series <https://www.mouser.com/datasheet/2/447/Yageo_PYu_AC_51_RoHS_L_7_1714230-1874691.pdf> PU Series <https://www.mouser.com/datasheet/2/447/PYu-PU_51_RoHS_L_6-1504619.pdf> ERA Series <https://www.mouser.com/datasheet/2/315/AOA0000C307-1149632.pdf> PWR263 Series <https://www.mouser.com/datasheet/2/54/pwr263s_35-778069.pdf> KTR Series <https://www.mouser.com/datasheet/2/348/ROHM_S_A0011075115_1-2563276.pdf> RC Series <https://www.mouser.com/datasheet/2/447/Yageo_03_18_2021_PYu_RC_Group_51_RoHS_L_11-2199992.pdf> ERJ PB3, PB6 Series <https://www.mouser.com/datasheet/2/315/AOA0000C328-1530132.pdf> ERJ PA2, P03, PA3, P06, P08, P14 Series <https://www.mouser.com/datasheet/2/315/AOA0000C331-1141874.pdf> B20 Series <https://www.ohmite.com/assets/docs/res_200.pdf?r=false> TE Connectivity/Holsworthy RN73 Series <https://www.mouser.com/datasheet/2/418/4/NG_DS_1773270_M-604713.pdf> Vishay Dale D/CRCW e3 <https://www.mouser.com/datasheet/2/427/dcrcwe3-1762152.pdf> Ohmite B20 <https://www.ohmite.com/assets/docs/res_200.pdf?r=false>; DKPN: YAG4603TR-ND; MANUFACTURER: Yageo; MOPN: 603-RT0603BRD078K66L; MPN: RT0603BRD078K66L; POWER: 0.1W; RESISTANCE: 8.66k; TOLERANCE: 0.1%; VOLTAGE_CONTINUOUS: 29.43V; VOLTAGE_MAX: 75V
R15 = HyTechDevices:RESISTOR_?_*: Resistor PWR163 Series <https://www.mouser.com/datasheet/2/54/pwr163-777985.pdf> AC Series <https://www.mouser.com/datasheet/2/447/Yageo_PYu_AC_51_RoHS_L_7_1714230-1874691.pdf> PU Series <https://www.mouser.com/datasheet/2/447/PYu-PU_51_RoHS_L_6-1504619.pdf> ERA Series <https://www.mouser.com/datasheet/2/315/AOA0000C307-1149632.pdf> PWR263 Series <https://www.mouser.com/datasheet/2/54/pwr263s_35-778069.pdf> KTR Series <https://www.mouser.com/datasheet/2/348/ROHM_S_A0011075115_1-2563276.pdf> RC Series <https://www.mouser.com/datasheet/2/447/Yageo_03_18_2021_PYu_RC_Group_51_RoHS_L_11-2199992.pdf> ERJ PB3, PB6 Series <https://www.mouser.com/datasheet/2/315/AOA0000C328-1530132.pdf> ERJ PA2, P03, PA3, P06, P08, P14 Series <https://www.mouser.com/datasheet/2/315/AOA0000C331-1141874.pdf> B20 Series <https://www.ohmite.com/assets/docs/res_200.pdf?r=false> TE Connectivity/Holsworthy RN73 Series <https://www.mouser.com/datasheet/2/418/4/NG_DS_1773270_M-604713.pdf> Vishay Dale D/CRCW e3 <https://www.mouser.com/datasheet/2/427/dcrcwe3-1762152.pdf> Ohmite B20 <https://www.ohmite.com/assets/docs/res_200.pdf?r=false>; DKPN: 311-1.00MHRCT-ND; MANUFACTURER: Yageo; MOPN: 603-RC0603FR-071ML; MPN: RC0603FR-071ML; POWER: 0.1W; RESISTANCE: 1M; TOLERANCE: 1%; VOLTAGE_CONTINUOUS: 75V; VOLTAGE_MAX: 75V
U1 = HyTechDevices:VOLTAGE_REGULATOR_ISO_?_*: Isolated voltage regulator MEE3XXXXSC Datasheet <https://www.mouser.com/datasheet/2/281/1/kdc_mee3-2940988.pdf> PQP1-D Datasheet <https://www.mouser.com/datasheet/2/670/pqp1_d-1825516.pdf>; DKPN: 102-PQP1-D24-S12-D-ND; MANUFACTURER: CUI Inc.; MOPN: 490-PQP1-D24-S12-D; MPN: PQP1-D24-S12-D
U2 = HyTechDevices:ISO224*: ISO224*: Isolated precision amplifier ISO224A: Low-Grade ISO224B: High-Grade ISO224* Datasheet <https://www.ti.com/lit/ds/symlink/iso224.pdf?HQS=dis-dk-null-digikeymode-dsf-pf-null-wwe&ts=1625423566252&ref_url=https%253A%252F%252Fwww.ti.com%252Fgeneral%252Fdocs%252Fsuppproductinfo.tsp%253FdistId%253D10%2526gotoUrl%253Dhttps%253A%252F%252Fwww.ti.com%252Flit%252Fgpn%252Fiso224>; DKPN: 296-52315-1-ND; MANUFACTURER: Texas Instruments; MOPN: 595-ISO224ADWVR; MPN: ISO224ADWVR
U3 = HyTechDevices:VOLTAGE_REGULATOR_?_*: Voltage Regulators LDL1117S50R Datasheet <https://www.mouser.com/datasheet/2/389/dm00366442-1799212.pdf> NCP785AH120T1G <https://www.mouser.com/datasheet/2/308/NCP785A_D-1812704.pdf> LMS8117A Datasheet <https://www.ti.com/lit/ds/symlink/lms8117a.pdf?HQS> ST732M50R Datasheet <https://www.mouser.com/datasheet/2/389/st732-1830546.pdf> LM2937IMPX-10/NOPB Datasheet <https://www.ti.com/lit/ds/symlink/lm2937.pdf>; DKPN: 497-ST732M50RTR-ND; MANUFACTURER: STMicroelectronics; MOPN: 511-ST732M50R; MPN: ST732M50R
U4 U5 = HyTechDevices:OPAMP_1_CHANNEL_*: Op-Amp 1 Channel OPA991 Datasheet <https://www.ti.com/lit/ds/symlink/opa991.pdf?ts=1615503614502> Note: OPA991 is also a comparator; DKPN: 296-OPA991IDCKRCT-ND; MANUFACTURER: Texas Instruments; MOPN: 595-OPA991IDCKR; MPN: OPA991IDCKR

## Board
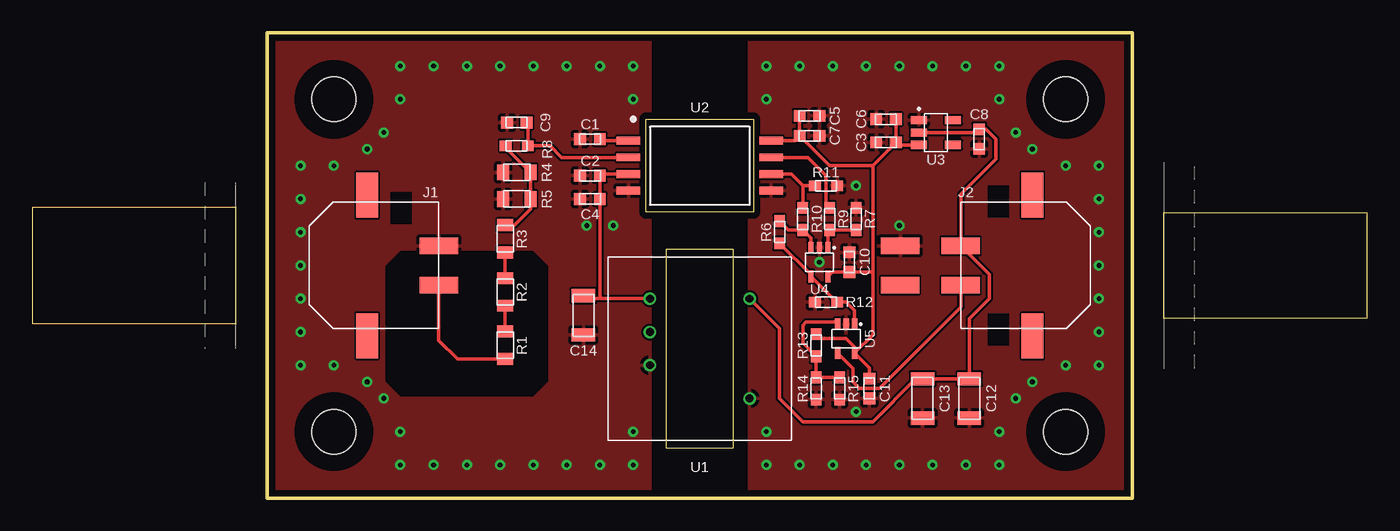
[diagram p2: board, top side]
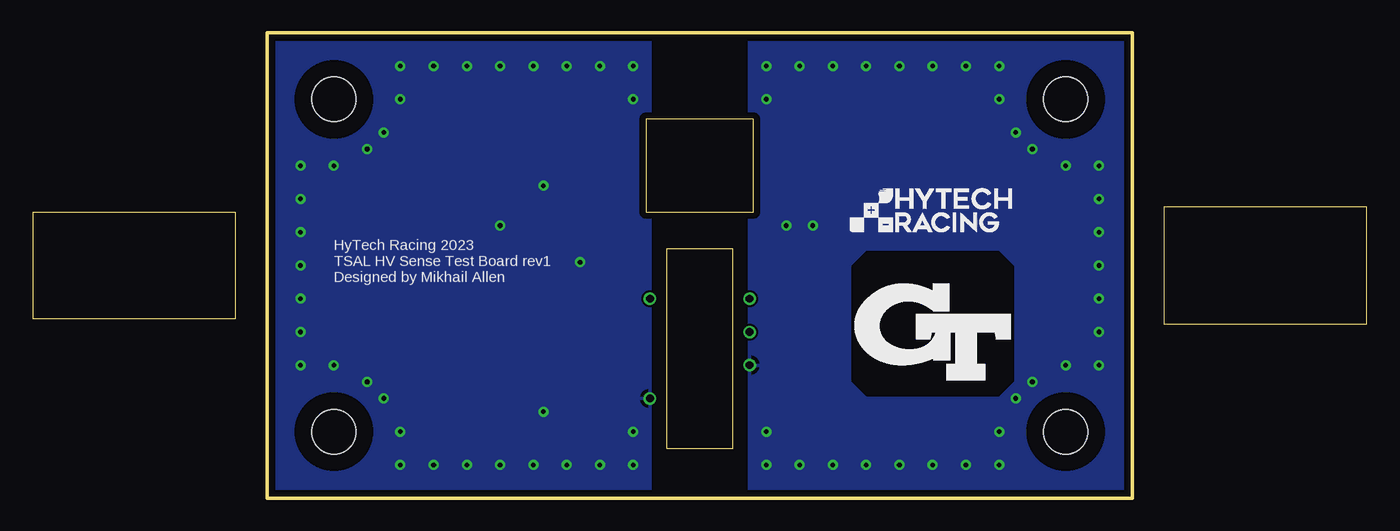
[diagram p3: board, bottom side, seen from below]

Size 66.04 x 35.56 mm. Coordinates in mm from the lower left corner, seen from the top.
Outline: 0,0 66.04,0 66.04,35.56 0,35.56 0,0
Copper layers (1*16): Top 0.035mm / dielectric 1.53mm / Bottom 0.035mm
Design rules "HyTech Default (2 Layer)": minimum track width 6mil, minimum drill 14mil, track to track 6mil, track to pad 6mil, pad to pad 6mil, via to via 20mil, smd to smd 6mil, copper to edge 20mil, drill to drill 21mil, minimum pad ring 7mil, minimum via ring 8mil, stop-mask expansion 6mil, vias tented up to drill 30mil, thermal gap 10mil

### Footprints (pad centres in the part's own frame; a part is rotated, then mirrored left to right if it is on the bottom)
0603-CAP = smd 0.9 x 0.9: 1 -0.75,0; 2 0.75,0
1206-CAP = smd 1 x 1.8: 1 -1.5,0; 2 1.5,0
MOLEX_MICROFIT_SMD_RIGHTANGLE_02_SINGLE = smd 1.27 x 2.921: 1 1.499,5.474; 2 -1.499,5.474 | smd 3.429 x 1.651: PAD1 5.372,0; PAD2 -5.372,0
MOLEX_MICROFIT_SMD_RIGHTANGLE_04_DUAL = smd 1.27 x 2.921: 1 1.5,5.474; 2 -1.5,5.474; 3 1.5,10.097; 4 -1.5,10.097 | smd 3.429 x 1.651: PAD1 5.386,0; PAD2 -5.386,0
0805-RES = smd 0.9 x 1.2: 1 -1.05,0; 2 1.05,0
0603-RES = smd 0.9 x 0.8: 1 -0.85,0; 2 0.85,0
PQP1-D = drill 0.6: 1 -3.81,-3.81; 4 3.81,-3.81; 5 3.81,3.81; 6 1.27,3.81; 7 -1.27,3.81
SOIC-08(WIDE,0.295")-AIRGAP = smd 0.6 x 1.8: 1 -1.905,-5.45; 2 -0.635,-5.45; 3 0.635,-5.45; 4 1.905,-5.45; 5 1.905,5.45; 6 0.635,5.45; 7 -0.635,5.45; 8 -1.905,5.45
SOT-23-5 = smd 0.62 x 1.22: 1 -0.95,-1.31; 2 0,-1.31; 3 0.95,-1.31; 4 0.95,1.31; 5 -0.95,1.31
SC-70-5 = smd 0.4 x 0.9: 1 -0.65,-1.1; 2 0,-1.1; 3 0.65,-1.1; 4 0.65,1.1; 5 -0.65,1.1
MOUNTING_M3 = hole 3.4: 0,0

### Placement (x,y rotation side)
C1  24.64,27.43 180 top
C2  24.64,24.64 180 top
C3  47.24,27.18 180 top
C4  24.64,22.86 180 top
C5  41.4,29.21 0 top
C6  47.24,28.96 180 top
C7  41.4,27.69 0 top
C8  54.36,27.43 270 top
C9  19.05,28.7 180 top
C10  44.45,18.03 90 top
C11  45.97,8.38 270 top
C12  53.59,7.62 270 top
C13  50.04,7.62 270 top
C14  24.13,13.97 270 top
J1  7.62,17.78 270 top
J2  58.42,17.78 90 top
R1  18.16,11.68 270 top
R2  18.16,15.75 270 top
R3  18.16,19.81 270 top
R4  19.05,24.89 0 top
R5  19.05,22.86 0 top
R6  39.12,20.32 270 top
R7  44.96,21.34 90 top
R8  19.05,26.92 0 top
R9  42.93,21.34 270 top
R10  40.89,21.34 270 top
R11  42.67,23.88 180 top
R12  42.67,14.99 0 top
R13  41.91,11.68 90 top
R14  41.91,8.38 90 top
R15  43.69,8.38 90 top
U1  33.02,11.43 90 top
U2  33.02,25.4 270 top
U3  51.05,27.94 270 top
U4  42.16,18.03 180 top
U5  44.2,12.19 180 top
U$5  [MOUNTING_M3]  5.08,5.08 0 top
U$6  [MOUNTING_M3]  5.08,30.48 0 top
U$7  [MOUNTING_M3]  60.96,30.48 0 top
U$8  [MOUNTING_M3]  60.96,5.08 0 top
U$10  [LOGO_GT_MEDIUM]  15.24,12.7 0 bottom
U$11  [LOGO_HYTECH_SMALL]  21.59,20.32 0 bottom

### Tracks (layer width: path | path; a pad name or v marks a point on that pad's centre or on a via)
0.525V_DIV
  Top 0.254: U5.3 43.38,13.46 41.15,13.46 40.89,13.21 40.89,11.85 R13.1 R14.2 R15.2
+5V
  Top 0.254: U2.8 40.27,27.3 C7.1 | C7.1 C5.1 | U3.3 48.18,26.99 C3.1 | C3.1 C6.1 | R13.2 42.25,12.19 44.2,12.19 44.85,11.54 U5.5 | U4.5 43.16,17.28 C10.1 44.46,17.27 46.23,17.27 | U5.5 46.23,12.47 46.23,17.27 | C3.1 46.23,25.41 46.23,25.4 | 46.23,17.27 46.23,25.4 | 46.23,25.4 42.94,25.4 C7.1 | U5.5 45.97,9.96 C11.1
+24V
  Top 0.254: U3.2 54.11,27.94 C8.1 54.86,28.18 55.63,27.42 55.63,25.91 52.95,23.23 J2.1 55.12,17.11 55.12,15.24 53.59,13.72 C12.1 C13.1 49.51,9.12 46.23,5.84 40.89,5.84 39.12,7.62 39.12,12.95 U1.4
GND  (via drill 0.36)
  other vias: 38.1,33.02 38.1,30.48 38.1,2.54 38.1,5.08 40.64,2.54 43.18,2.54 45.72,2.54 48.26,2.54 50.8,2.54 53.34,2.54 55.88,2.54 55.88,5.08 57.15,7.62 40.64,33.02 43.18,33.02 45.72,33.02 48.26,33.02 50.8,33.02 53.34,33.02 55.88,33.02 55.88,30.48 57.15,27.94 60.96,25.4 63.5,25.4 63.5,22.86 63.5,20.32 63.5,17.78 63.5,15.24 63.5,12.7 63.5,10.16 60.96,10.16 58.42,8.89 58.42,26.67 42.16,18.03 48.26,20.83 44.96,6.6 44.96,23.88
  pour Top: 36.83,35.56 36.83,0 66.04,0 66.04,35.56
  pour Bottom: 36.83,36.83 36.83,-1.27 67.31,-1.27 67.31,36.83
N$1
  Top 0.254: U2.1 25.52,27.3 C1.1
N$2
  Top 0.254: U4.1 42.81,20.37 R9.2 R7.1
N$3
  Top 0.254: U4.3 41.51,19.87 R10.2 39.8,20.49 R6.1
N$4
  Top 0.254: R2.1 R3.2
N$5
  Top 0.254: R1.1 R2.2
N$7
  Top 0.254: U2.6 40.01,24.77 40.89,23.88 | 40.89,23.88 R10.1 | 40.89,23.88 R11.2
N$8
  Top 0.254: U2.7 41.27,26.04 42.67,24.64 42.67,22.44 R9.1
TS+12V
  Top 0.254: U2.3 25.52,24.77 C2.1 C4.1 25.4,22.85 25.4,15.24 | C14.1 24.36,15.24 25.4,15.24 | 25.4,15.24 U1.5
TS+UNFUSED
  Top 0.254: J1.1 13.09,12.05 14.51,10.63 R1.2
TS-UNFUSED  (via drill 0.36)
  other vias: 10.16,2.54 12.7,2.54 15.24,2.54 17.78,2.54 20.32,2.54 22.86,2.54 25.4,2.54 27.94,2.54 10.16,5.08 27.94,5.08 27.94,33.02 27.94,30.48 25.4,33.02 22.86,33.02 20.32,33.02 17.78,33.02 15.24,33.02 12.7,33.02 10.16,33.02 10.16,30.48 7.62,26.67 5.08,25.4 2.54,25.4 2.54,22.86 2.54,20.32 2.54,17.78 2.54,15.24 2.54,12.7 2.54,10.16 5.08,10.16 7.62,8.89 8.89,7.62 8.89,27.94 26.42,20.83 24.38,20.83
  pour Top: 0,35.56 0,17.78 8.89,17.78 10.16,19.05 20.32,19.05 21.59,17.78 29.21,17.78 29.21,35.56
  pour Top: 0,17.78 0,0 29.21,0 29.21,17.78 21.59,17.78 21.59,8.89 20.32,7.62 10.16,7.62 8.89,8.89 8.89,17.78
  pour Bottom: -1.27,36.83 -1.27,17.78 8.89,17.78 10.16,19.05 20.32,19.05 21.59,17.78 29.21,17.78 29.21,36.83
  pour Bottom: -1.27,17.78 -1.27,-1.27 29.21,-1.27 29.21,17.78 21.59,17.78 21.59,8.89 20.32,7.62 10.16,7.62 8.89,8.89 8.89,17.78
TS_ACTIVE_GLV
  Top 0.254: J2.2 52.95,14.59 46.74,8.38 45.21,8.38 44.7,8.89 44.7,9.93 U5.4
TS_DIVIDED
  Top 0.254: R3.1 18.86,20.86 20.1,22.1 R5.2 20.1,23.62 R4.2 18.2,26.79 R8.1
TS_FILTERED
  Top 0.254: U2.2 22.48,26.04 21.59,26.92 R8.2 19.9,28.6 C9.1
TS_ISO
  Top 0.254: U5.1 44.85,14.34 44.2,14.99 R12.2 43.46,14.99 U4.4 41.51,17.07 R6.2

### Text on the board
bPlace: HyTech Racing 2023 / TSAL HV Sense Test Board rev1 / Designed by Mikhail Allen